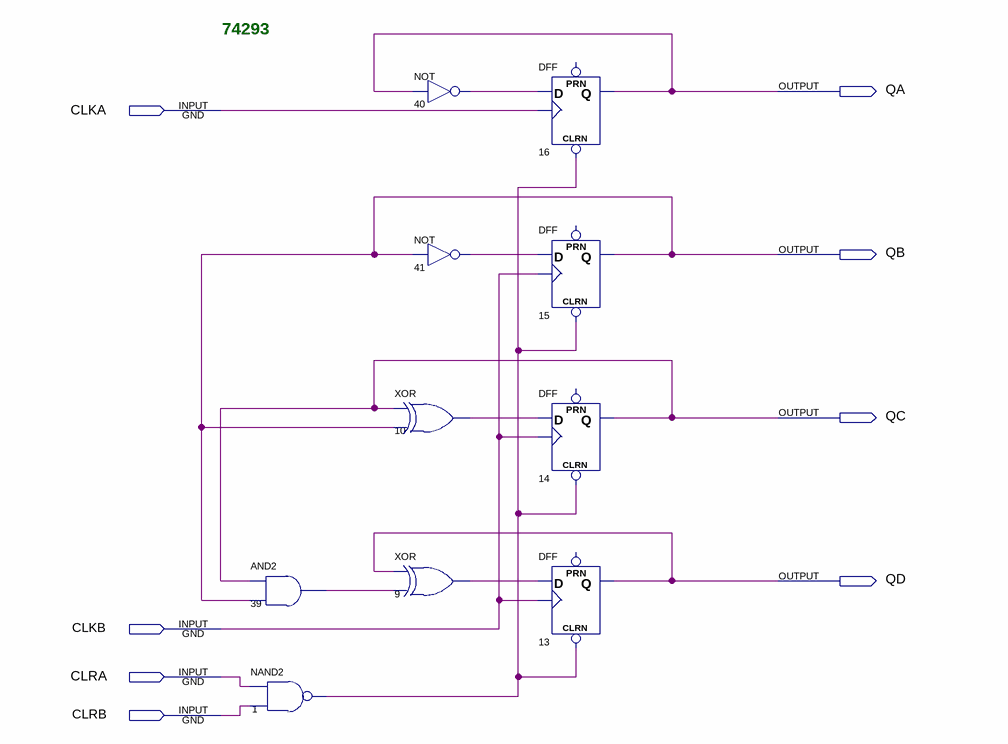
[diagram p0: schematic sheet]
// Quartus schematic 74293.bdf as structural Verilog: 10 symbols, 8 pins
module \74293  (
  input  CLKA,
  input  CLKB,
  input  CLRA,
  input  CLRB,
  output QA,
  output QB,
  output QC,
  output QD
);

  wire n1_out, n9_out, n10_out, n39_out, n40_out, n41_out;

  and u_39 (n39_out, QC, QB);
  nand u_1 (n1_out, CLRA, CLRB);
  not u_40 (n40_out, QA);
  not u_41 (n41_out, QB);
  xor u_10 (n10_out, QC, QB);
  xor u_9 (n9_out, QD, n39_out);
  DFF u_16 (.CLRN(n1_out), .CLK(CLKA), .D(n40_out), .Q(QA));  // open: PRN
  DFF u_15 (.CLRN(n1_out), .CLK(CLKB), .D(n41_out), .Q(QB));  // open: PRN
  DFF u_14 (.CLRN(n1_out), .CLK(CLKB), .D(n10_out), .Q(QC));  // open: PRN
  DFF u_13 (.CLRN(n1_out), .CLK(CLKB), .D(n9_out), .Q(QD));  // open: PRN

  // Notes on the sheet:
  //   74293
endmodule
